# EAGLE design led_shield (EAGLE 7.2.0)
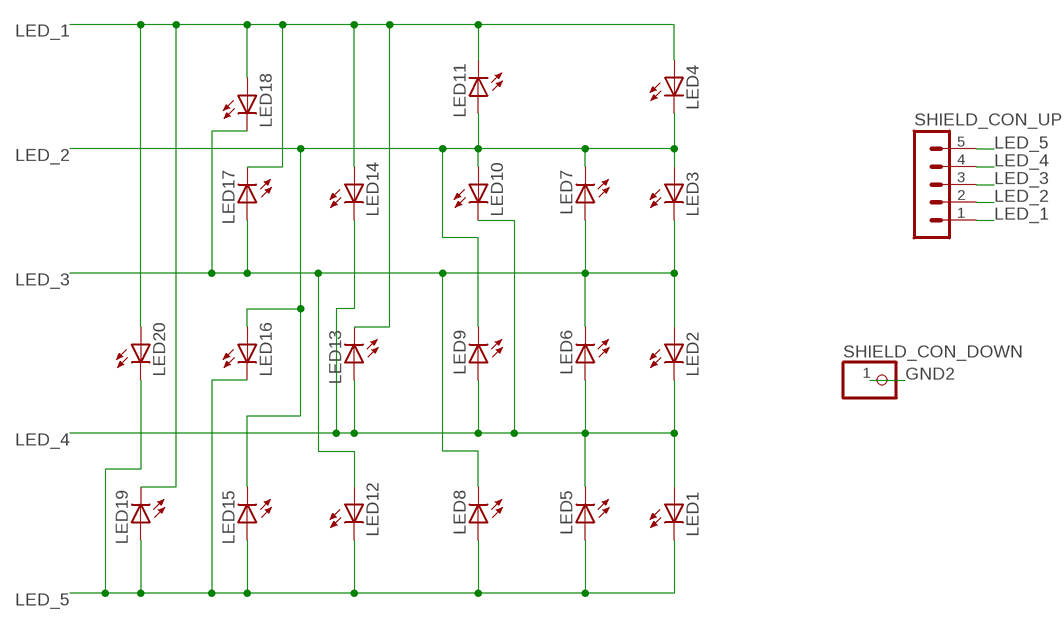
[diagram p0: schematic, sheet 1]

## Parts
LED1  LEDCHIP-LED0603  [CHIP-LED0603]
LED2  LEDCHIP-LED0603  [CHIP-LED0603]
LED3  LEDCHIP-LED0603  [CHIP-LED0603]
LED4  LEDCHIP-LED0603  [CHIP-LED0603]
LED5  LEDCHIP-LED0603  [CHIP-LED0603]
LED6  LEDCHIP-LED0603  [CHIP-LED0603]
LED7  LEDCHIP-LED0603  [CHIP-LED0603]
LED8  LEDCHIP-LED0603  [CHIP-LED0603]
LED9  LEDCHIP-LED0603  [CHIP-LED0603]
LED10  LEDCHIP-LED0603  [CHIP-LED0603]
LED11  LEDCHIP-LED0603  [CHIP-LED0603]
LED12  LEDCHIP-LED0603  [CHIP-LED0603]
LED13  LEDCHIP-LED0603  [CHIP-LED0603]
LED14  LEDCHIP-LED0603  [CHIP-LED0603]
LED15  LEDCHIP-LED0603  [CHIP-LED0603]
LED16  LEDCHIP-LED0603  [CHIP-LED0603]
LED17  LEDCHIP-LED0603  [CHIP-LED0603]
LED18  LEDCHIP-LED0603  [CHIP-LED0603]
LED19  LEDCHIP-LED0603  [CHIP-LED0603]
LED20  LEDCHIP-LED0603  [CHIP-LED0603]
SHIELD_CON_DOWN  PINHD-1X1  [1X01]
SHIELD_CON_UP  MA05-1  [MA05-1]

## Nets
GND2: SHIELD_CON_DOWN.1
LED_1: LED4.A LED11.C LED13.C LED14.A LED17.C LED18.A LED19.C LED20.A SHIELD_CON_UP.1
LED_2: LED3.A LED4.C LED7.C LED9.C LED10.A LED11.A LED15.C LED16.A SHIELD_CON_UP.2
LED_3: LED2.A LED3.C LED6.C LED7.A LED8.C LED12.A LED17.A LED18.C SHIELD_CON_UP.3
LED_4: LED1.A LED2.C LED5.C LED6.A LED9.A LED10.C LED13.A LED14.C SHIELD_CON_UP.4
LED_5: LED1.C LED5.A LED8.A LED12.C LED15.A LED16.C LED19.A LED20.C SHIELD_CON_UP.5

## Library data of the parts
LED1-LED20 = led:LED: LED OSRAM: - CHIPLED LG R971, LG N971, LY N971, LG Q971, LY Q971, LO R971, LY R971 LH N974, LH R974 LS Q976, LO Q976, LY Q976 LO Q996 - Hyper CHIPLED LW Q18S LB Q993, LB Q99A, LB R99A - SideLED LS A670, LO A670, LY A670, LG A670, LP A670 LB A673, LV A673, LT A673, LW A673 LH A674 LY A675 LS A676, LA A676, LO A676, LY A676, LW A676 LS A679, LY A679, LG A679 - Hyper Micro SIDELED® LS Y876, LA Y876, LO Y876, LY Y876 LT Y87S - SmartLED LW L88C, LW L88S LB L89C, LB L89S, LG L890 LS L89K, LO L89K, LY L89K LS L896, LA L896, LO L896, LY L896 - TOPLED LS T670, LO T670, LY T670, LG T670, LP T670 LSG T670, LSP T670, LSY T670, LOP T670, LYG T670 LG T671, LOG T671, LSG T671 LB T673, LV T673, LT T673, LW T673 LH T674 LS T676, LA T676, LO T676, LY T676, LB T676, LH T676, LSB T676, LW T676 LB T67C, LV T67C, LT T67C, LS T67K, LO T67K, LY T67K, LW E67C LS E67B, LA E67B, LO E67B, LY E67B, LB E67C, LV E67C, LT E67C LW T67C LS T679, LY T679, LG T679 LS T770, LO T770, LY T770, LG T770, LP T770 LB T773, LV T773, LT T773, LW T773 LH T774 LS E675, LA E675, LY E675, LS T675 LS T776, LA T776, LO T776, LY T776, LB T776 LHGB T686 LT T68C, LB T68C - Hyper Mini TOPLED® LB M676 - Mini TOPLED Santana® LG M470 LS M47K, LO M47K, LY M47K Source: http://www.osram.convergy.de LUXEON: - LUMILED® LXK2-PW12-R00, LXK2-PW12-S00, LXK2-PW14-U00, LXK2-PW14-V00 LXK2-PM12-R00, LXK2-PM12-S00, LXK2-PM14-U00 LXK2-PE12-Q00, LXK2-PE12-R00, LXK2-PE12-S00, LXK2-PE14-T00, LXK2-PE14-U00 LXK2-PB12-K00, LXK2-PB12-L00, LXK2-PB12-M00, LXK2-PB14-N00, LXK2-PB14-P00, LXK2-PB14-Q00 LXK2-PR12-L00, LXK2-PR12-M00, LXK2-PR14-Q00, LXK2-PR14-R00 LXK2-PD12-Q00, LXK2-PD12-R00, LXK2-PD12-S00 LXK2-PH12-R00, LXK2-PH12-S00 LXK2-PL12-P00, LXK2-PL12-Q00, LXK2-PL12-R00 Source: www.luxeon.com KINGBRIGHT: KA-3528ASYC Source: www.kingbright.com
SHIELD_CON_DOWN = pinhead:PINHD-1X1: PIN HEADER
SHIELD_CON_UP = con-lstb:MA05-1: PIN HEADER; OC_FARNELL: unknown; OC_NEWARK: unknown

## Board
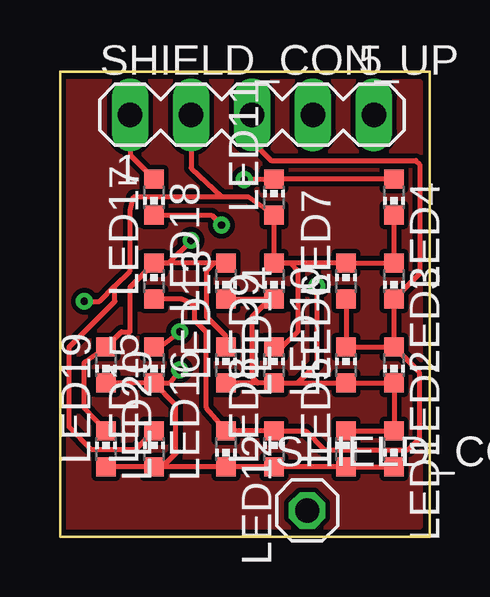
[diagram p1: board, top side]
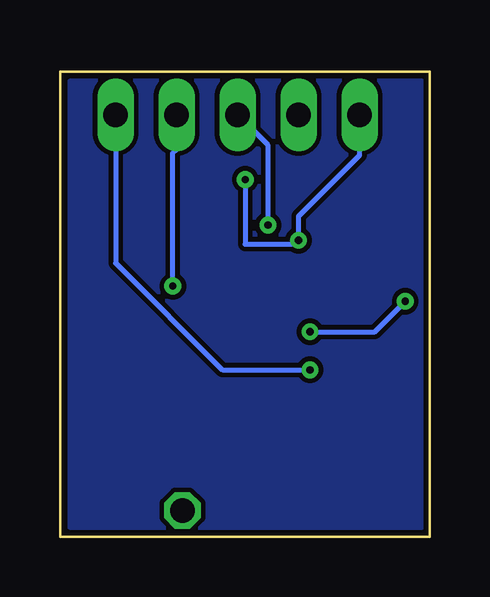
[diagram p2: board, bottom side, seen from below]

Size 15.4 x 19.4 mm. Coordinates in mm from the lower left corner, seen from the top.
Outline: 0,19.4 15.4,19.4 15.4,0 0,0 0,19.4
Copper layers (1*16): Top 0.018mm / dielectric 1.5mm / Bottom 0.018mm
Design rules "apama_pool_2_layers": minimum track width 0.2mm, minimum drill 0.3mm, track to track 0.2mm, track to pad 0.2mm, pad to pad 0.2mm, via to via 0.2mm, smd to smd 0.2mm, copper to edge 0.2mm, drill to drill 0.3mm, minimum pad ring 0.2mm, minimum via ring 0.2mm, stop-mask expansion 0.15mm, vias tented up to drill 0.3mm, thermal gap 10mil

### Footprints (pad centres in the part's own frame; a part is rotated, then mirrored left to right if it is on the bottom)
CHIP-LED0603 = smd 0.8 x 0.8: A 0,-0.75; C 0,0.75
1X01 = drill 1.016 octagon: 1 0,0
MA05-1 = drill 1.016 long: 1 -5.08,0; 2 -2.54,0; 3 0,0; 4 2.54,0; 5 5.08,0

### Placement (x,y rotation side)
LED1  13.92,3.66 180 top
LED2  13.92,7.16 180 top
LED3  13.92,10.66 180 top
LED4  13.92,14.16 180 top
LED5  11.92,3.66 0 top
LED6  11.92,7.16 0 top
LED7  11.92,10.66 0 top
LED8  8.92,3.66 0 top
LED9  8.92,7.16 0 top
LED10  8.92,10.66 180 top
LED11  8.92,14.16 0 top
LED12  6.92,3.66 180 top
LED13  6.92,7.16 0 top
LED14  6.92,10.66 180 top
LED15  3.92,3.66 0 top
LED16  3.92,7.16 180 top
LED17  3.92,10.66 0 top
LED18  3.92,14.16 180 top
LED19  1.92,3.66 0 top
LED20  1.92,7.16 180 top
SHIELD_CON_DOWN  10.3,1.1 0 top
SHIELD_CON_UP  8,17.6 0 top

### Tracks (layer width: path | path; a pad name or v marks a point on that pad's centre or on a via)
GND
  pour Top (isolate 0.127): 15,0.4 0.3,0.4 0.3,19 15,19
LED_1  (via drill 0.3)
  Top 0.2: LED4.A LED11.C v7.68,14.9 | LED17.C LED14.A 6.42,11.41 6.09,11.09 6.09,9.19 6.89,8.39 6.89,7.94 LED13.C | LED17.C 2.92,10.41 2.92,8.55 2.56,8.55 LED20.A 1.01,7.28 1.01,5.38 LED19.C | SHIELD_CON_UP.1 2.92,15.91 LED18.A | LED17.C 4.51,11.41 v5.46,12.36
  Bottom 0.2: SHIELD_CON_UP.1 2.92,15.91 5.46,13.37 v5.46,12.36 arc90 5.62,12.2 7.68,12.2 v7.68,14.9
LED_2  (via drill 0.3)
  Top 0.2: LED4.C LED3.A LED7.C LED10.A | LED10.A 9.59,11.41 9.9,11.09 9.9,8.55 9.27,7.92 LED9.C | LED10.A LED11.A 7.84,14.19 6.73,14.19 | LED15.C 3.14,3.63 1.33,3.63 0.38,4.58 0.38,7.92 2.29,9.82 2.29,10.46 | 2.29,10.46 2.92,11.09 2.92,13.63 3.08,14.19 6.73,14.19 | SHIELD_CON_UP.2 5.46,15.38 6.73,14.19 | LED16.A 4.19,7.91 v4.98,8.55 | v1.01,9.82 1.65,9.82 2.29,10.46
  Bottom 0.2: v4.98,8.55 2.29,8.55 v1.01,9.82
LED_3  (via drill 0.3)
  Top 0.2: LED2.A LED6.C LED7.A | LED2.A LED3.C 14.98,10.98 14.98,15.54 14.83,15.7 8.79,15.7 8,16.49 SHIELD_CON_UP.3 | LED2.A 14.98,6.85 14.98,4.11 14.51,3.63 11.02,3.63 10.23,4.41 LED8.C LED12.A 6.09,5.38 6.09,8.55 5.62,9.03 5.62,9.66 5.05,9.91 LED17.A | LED18.C 6.31,13.41 v6.73,13
  Bottom 0.2: v6.73,13 6.73,16.33 SHIELD_CON_UP.3
LED_4  (via drill 0.3)
  Top 0.2: LED5.C LED1.A LED2.C LED6.A 9.9,6.41 | LED9.A 9.9,6.41 | LED9.A LED13.A | LED14.C LED10.C 8.63,9.82 8,9.19 8,6.65 8.23,6.41 LED9.A | LED9.A 9.67,6.41 | v10.7,10.46 10.7,7.21 9.9,6.41
  Bottom 0.2: v10.7,10.46 10.7,16.01 10.54,16.17 SHIELD_CON_UP.4
LED_5  (via drill 0.3)
  Top 0.2: LED1.C LED5.A 11.92,2.84 11.81,2.84 11.81,2.91 LED8.A LED12.C LED15.A | LED15.A LED19.A | LED16.C LED20.C | LED15.A 4.27,2.91 4.83,3.47 4.83,5.51 LED16.C | LED16.C 4.59,6.41 v4.98,6.96
  Bottom 0.2: SHIELD_CON_UP.5 13.08,11.41 8.63,6.96 v4.98,6.96
N$1
  pour Bottom (isolate 0.127): 0.3,19 15,19 15,0.4 0.3,0.4